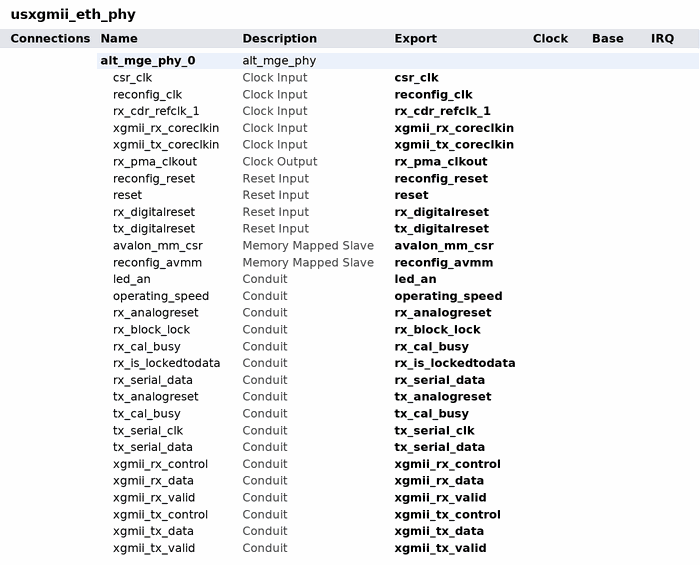
[diagram p0: system contents]
# Platform Designer (Qsys) system usxgmii_eth_phy, Arria 10 10AS066H2F34I1SG
# Parameters at their usual value, and those the tool derives, are not listed.
package require qsys
create_system usxgmii_eth_phy
set_project_property DEVICE_FAMILY {Arria 10}
set_project_property DEVICE 10AS066H2F34I1SG

add_instance alt_mge_phy_0 alt_mge_phy 17.1
set_instance_property alt_mge_phy_0 AUTO_EXPORT true
set_instance_parameter_value alt_mge_phy_0 DEFAULT_MODE 3
set_instance_parameter_value alt_mge_phy_0 ENABLE_IEEE1588 0
set_instance_parameter_value alt_mge_phy_0 EXT_PHY_MGBASET 0
set_instance_parameter_value alt_mge_phy_0 EXT_PHY_NBASET 1
set_instance_parameter_value alt_mge_phy_0 PHY_IDENTIFIER 305419896
set_instance_parameter_value alt_mge_phy_0 REFCLK_FREQ_BASER 0
set_instance_parameter_value alt_mge_phy_0 SHOW_HIDDEN_OPTIONS 0
set_instance_parameter_value alt_mge_phy_0 SPEED_VARIANT 4
set_instance_parameter_value alt_mge_phy_0 TX_PLL_CLOCK_NETWORK_1G xN
set_instance_parameter_value alt_mge_phy_0 TX_PLL_CLOCK_NETWORK_2P5G xN
set_instance_parameter_value alt_mge_phy_0 TX_PMA_CLK_DIV_1G 1
set_instance_parameter_value alt_mge_phy_0 TX_PMA_CLK_DIV_2P5G 1
set_instance_parameter_value alt_mge_phy_0 XCVR_RCFG_JTAG_ENABLE 0
set_instance_parameter_value alt_mge_phy_0 XCVR_SET_CAPABILITY_REG_ENABLE 0
set_instance_parameter_value alt_mge_phy_0 XCVR_SET_CSR_SOFT_LOGIC_ENABLE 0
set_instance_parameter_value alt_mge_phy_0 XCVR_SET_ODI_SOFT_LOGIC_ENABLE 0
set_instance_parameter_value alt_mge_phy_0 XCVR_SET_PRBS_SOFT_LOGIC_ENABLE 0
set_instance_parameter_value alt_mge_phy_0 XCVR_SET_USER_IDENTIFIER 0

# exported interfaces
add_interface avalon_mm_csr avalon slave
set_interface_property avalon_mm_csr EXPORT_OF alt_mge_phy_0.avalon_mm_csr
add_interface csr_clk clock sink
set_interface_property csr_clk EXPORT_OF alt_mge_phy_0.csr_clk
add_interface led_an conduit end
set_interface_property led_an EXPORT_OF alt_mge_phy_0.led_an
add_interface operating_speed conduit end
set_interface_property operating_speed EXPORT_OF alt_mge_phy_0.operating_speed
add_interface reconfig_avmm avalon slave
set_interface_property reconfig_avmm EXPORT_OF alt_mge_phy_0.reconfig_avmm
add_interface reconfig_clk clock sink
set_interface_property reconfig_clk EXPORT_OF alt_mge_phy_0.reconfig_clk
add_interface reconfig_reset reset sink
set_interface_property reconfig_reset EXPORT_OF alt_mge_phy_0.reconfig_reset
add_interface reset reset sink
set_interface_property reset EXPORT_OF alt_mge_phy_0.reset
add_interface rx_analogreset conduit end
set_interface_property rx_analogreset EXPORT_OF alt_mge_phy_0.rx_analogreset
add_interface rx_block_lock conduit end
set_interface_property rx_block_lock EXPORT_OF alt_mge_phy_0.rx_block_lock
add_interface rx_cal_busy conduit end
set_interface_property rx_cal_busy EXPORT_OF alt_mge_phy_0.rx_cal_busy
add_interface rx_cdr_refclk_1 clock sink
set_interface_property rx_cdr_refclk_1 EXPORT_OF alt_mge_phy_0.rx_cdr_refclk_1
add_interface rx_digitalreset reset sink
set_interface_property rx_digitalreset EXPORT_OF alt_mge_phy_0.rx_digitalreset
add_interface rx_is_lockedtodata conduit end
set_interface_property rx_is_lockedtodata EXPORT_OF alt_mge_phy_0.rx_is_lockedtodata
add_interface rx_pma_clkout clock source
set_interface_property rx_pma_clkout EXPORT_OF alt_mge_phy_0.rx_pma_clkout
add_interface rx_serial_data conduit end
set_interface_property rx_serial_data EXPORT_OF alt_mge_phy_0.rx_serial_data
add_interface tx_analogreset conduit end
set_interface_property tx_analogreset EXPORT_OF alt_mge_phy_0.tx_analogreset
add_interface tx_cal_busy conduit end
set_interface_property tx_cal_busy EXPORT_OF alt_mge_phy_0.tx_cal_busy
add_interface tx_digitalreset reset sink
set_interface_property tx_digitalreset EXPORT_OF alt_mge_phy_0.tx_digitalreset
add_interface tx_serial_clk conduit end
set_interface_property tx_serial_clk EXPORT_OF alt_mge_phy_0.tx_serial_clk
add_interface tx_serial_data conduit end
set_interface_property tx_serial_data EXPORT_OF alt_mge_phy_0.tx_serial_data
add_interface xgmii_rx_control conduit end
set_interface_property xgmii_rx_control EXPORT_OF alt_mge_phy_0.xgmii_rx_control
add_interface xgmii_rx_coreclkin clock sink
set_interface_property xgmii_rx_coreclkin EXPORT_OF alt_mge_phy_0.xgmii_rx_coreclkin
add_interface xgmii_rx_data conduit end
set_interface_property xgmii_rx_data EXPORT_OF alt_mge_phy_0.xgmii_rx_data
add_interface xgmii_rx_valid conduit end
set_interface_property xgmii_rx_valid EXPORT_OF alt_mge_phy_0.xgmii_rx_valid
add_interface xgmii_tx_control conduit end
set_interface_property xgmii_tx_control EXPORT_OF alt_mge_phy_0.xgmii_tx_control
add_interface xgmii_tx_coreclkin clock sink
set_interface_property xgmii_tx_coreclkin EXPORT_OF alt_mge_phy_0.xgmii_tx_coreclkin
add_interface xgmii_tx_data conduit end
set_interface_property xgmii_tx_data EXPORT_OF alt_mge_phy_0.xgmii_tx_data
add_interface xgmii_tx_valid conduit end
set_interface_property xgmii_tx_valid EXPORT_OF alt_mge_phy_0.xgmii_tx_valid

set_interconnect_requirement {$system} qsys_mm.clockCrossingAdapter HANDSHAKE
set_interconnect_requirement {$system} qsys_mm.insertDefaultSlave FALSE
set_interconnect_requirement {$system} qsys_mm.maxAdditionalLatency 1

save_system usxgmii_eth_phy.qsys
